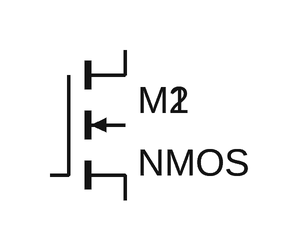
[diagram p0: schematic q3.asc]
q3.asc, the LTspice schematic file:
Version 4
SHEET 1 880 680
SYMBOL nmos4 224 160 R0
SYMATTR InstName M1
SYMBOL nmos4 224 160 R0
SYMATTR InstName M2

The netlist it stands for:
* q3.asc
M1 P001 P002 P003 P004 NMOS
M2 P001 P002 P003 P004 NMOS
.model NMOS NMOS
.model PMOS PMOS
.lib standard.mos
.backanno
.end